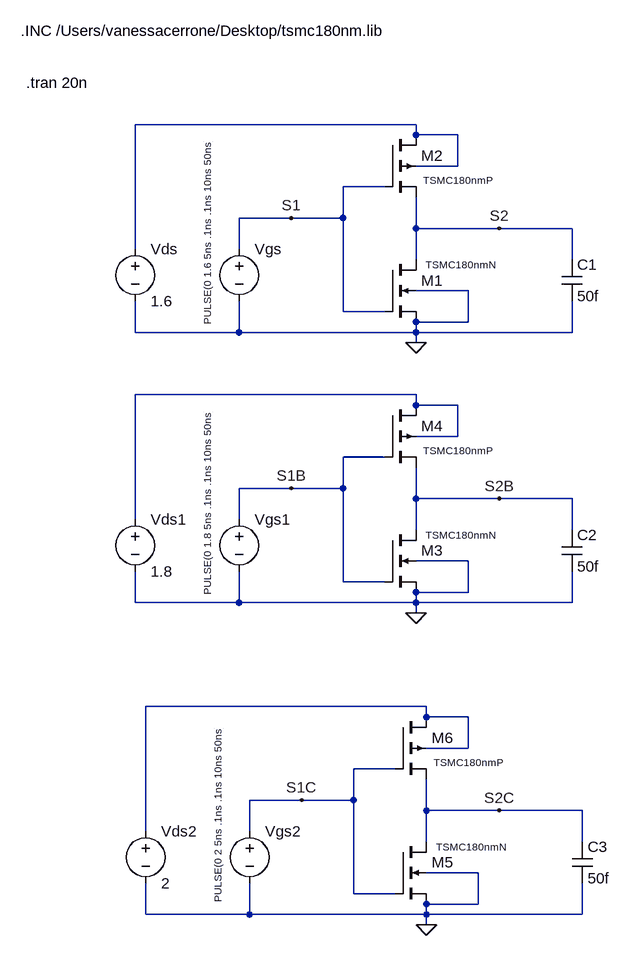
[diagram p0: schematic simulation.asc]
simulation.asc, the LTspice schematic file:
Version 4
SHEET 1 880 1488
WIRE 352 240 -80 240
WIRE 352 256 352 240
WIRE 416 256 352 256
WIRE 416 304 416 256
WIRE 416 304 352 304
WIRE 304 336 240 336
WIRE 160 384 80 384
WIRE 240 384 240 336
WIRE 240 384 160 384
WIRE 352 400 352 352
WIRE 480 400 352 400
WIRE 592 400 480 400
WIRE -80 432 -80 240
WIRE 80 432 80 384
WIRE 352 448 352 400
WIRE 592 448 592 400
WIRE 432 496 352 496
WIRE 240 528 240 384
WIRE 304 528 240 528
WIRE 432 544 432 496
WIRE 432 544 352 544
WIRE -80 560 -80 512
WIRE 80 560 80 512
WIRE 80 560 -80 560
WIRE 352 560 352 544
WIRE 352 560 80 560
WIRE 592 560 592 512
WIRE 592 560 352 560
WIRE 352 576 352 560
WIRE 352 656 -80 656
WIRE 352 672 352 656
WIRE 416 672 352 672
WIRE 416 720 416 672
WIRE 416 720 352 720
WIRE 304 752 240 752
WIRE 160 800 80 800
WIRE 240 800 240 752
WIRE 240 800 160 800
WIRE 352 816 352 768
WIRE 480 816 352 816
WIRE 592 816 480 816
WIRE -80 848 -80 656
WIRE 80 848 80 800
WIRE 352 864 352 816
WIRE 592 864 592 816
WIRE 432 912 352 912
WIRE 240 944 240 800
WIRE 304 944 240 944
WIRE 432 960 432 912
WIRE 432 960 352 960
WIRE -80 976 -80 928
WIRE 80 976 80 928
WIRE 80 976 -80 976
WIRE 352 976 352 960
WIRE 352 976 80 976
WIRE 592 976 592 928
WIRE 592 976 352 976
WIRE 352 992 352 976
WIRE 368 1136 -64 1136
WIRE 368 1152 368 1136
WIRE 432 1152 368 1152
WIRE 432 1200 432 1152
WIRE 432 1200 368 1200
WIRE 320 1232 256 1232
WIRE 176 1280 96 1280
WIRE 256 1280 256 1232
WIRE 256 1280 176 1280
WIRE 368 1296 368 1248
WIRE 480 1296 368 1296
WIRE 608 1296 480 1296
WIRE -64 1328 -64 1136
WIRE 96 1328 96 1280
WIRE 368 1344 368 1296
WIRE 608 1344 608 1296
WIRE 448 1392 368 1392
WIRE 256 1424 256 1280
WIRE 320 1424 256 1424
WIRE 448 1440 448 1392
WIRE 448 1440 368 1440
WIRE -64 1456 -64 1408
WIRE 96 1456 96 1408
WIRE 96 1456 -64 1456
WIRE 368 1456 368 1440
WIRE 368 1456 96 1456
WIRE 608 1456 608 1408
WIRE 608 1456 368 1456
WIRE 368 1472 368 1456
FLAG 352 576 0
FLAG 160 384 S1
FLAG 352 992 0
FLAG 160 800 S1B
FLAG 368 1472 0
FLAG 176 1280 S1C
FLAG 480 400 S2
FLAG 480 816 S2B
FLAG 480 1296 S2C
SYMBOL voltage -80 416 R0
SYMATTR InstName Vds
SYMATTR Value 1.6
SYMBOL voltage 80 416 R0
WINDOW 3 -38 -7 VBottom 1
SYMATTR Value PULSE(0 1.6 5ns .1ns .1ns 10ns 50ns)
SYMATTR InstName Vgs
SYMBOL nmos4 304 448 R0
WINDOW 3 63 8 Left 1
SYMATTR Value TSMC180nmN
SYMATTR InstName M1
SYMATTR Value2 l=500n w=180n
SYMBOL pmos4 304 256 R0
WINDOW 3 59 70 Left 1
SYMATTR Value TSMC180nmP
SYMATTR InstName M2
SYMATTR Value2 l=1500n w=180n
SYMBOL cap 576 448 R0
SYMATTR InstName C1
SYMATTR Value 50f
SYMBOL voltage -80 832 R0
SYMATTR InstName Vds1
SYMATTR Value 1.8
SYMBOL voltage 80 832 R0
WINDOW 3 -38 -7 VBottom 1
SYMATTR Value PULSE(0 1.8 5ns .1ns .1ns 10ns 50ns)
SYMATTR InstName Vgs1
SYMBOL nmos4 304 864 R0
WINDOW 3 63 8 Left 1
SYMATTR Value TSMC180nmN
SYMATTR InstName M3
SYMATTR Value2 l=500n w=180n
SYMBOL pmos4 304 672 R0
WINDOW 3 59 70 Left 1
SYMATTR Value TSMC180nmP
SYMATTR InstName M4
SYMATTR Value2 l=1500n w=180n
SYMBOL cap 576 864 R0
SYMATTR InstName C2
SYMATTR Value 50f
SYMBOL voltage -64 1312 R0
SYMATTR InstName Vds2
SYMATTR Value 2
SYMBOL voltage 96 1312 R0
WINDOW 3 -38 -7 VBottom 1
SYMATTR Value PULSE(0 2 5ns .1ns .1ns 10ns 50ns)
SYMATTR InstName Vgs2
SYMBOL nmos4 320 1344 R0
WINDOW 3 63 8 Left 1
SYMATTR Value TSMC180nmN
SYMATTR InstName M5
SYMATTR Value2 l=500n w=180n
SYMBOL pmos4 320 1152 R0
WINDOW 3 59 70 Left 1
SYMATTR Value TSMC180nmP
SYMATTR InstName M6
SYMATTR Value2 l=1500n w=180n
SYMBOL cap 592 1344 R0
SYMATTR InstName C3
SYMATTR Value 50f
TEXT -256 96 Left 2 !.INC /Users/vanessacerrone/Desktop/tsmc180nm.lib
TEXT -248 176 Left 2 !.tran 20n

The netlist it stands for:
* simulation.asc
Vds N001 0 1.6
Vgs S1 0 PULSE(0 1.6 5ns .1ns .1ns 10ns 50ns)
M1 S2 S1 0 0 TSMC180nmN l=500n w=180n
M2 N001 S1 S2 N001 TSMC180nmP l=1500n w=180n
C1 S2 0 50f
Vds1 N002 0 1.8
Vgs1 S1B 0 PULSE(0 1.8 5ns .1ns .1ns 10ns 50ns)
M3 S2B S1B 0 0 TSMC180nmN l=500n w=180n
M4 N002 S1B S2B N002 TSMC180nmP l=1500n w=180n
C2 S2B 0 50f
Vds2 N003 0 2
Vgs2 S1C 0 PULSE(0 2 5ns .1ns .1ns 10ns 50ns)
M5 S2C S1C 0 0 TSMC180nmN l=500n w=180n
M6 N003 S1C S2C N003 TSMC180nmP l=1500n w=180n
C3 S2C 0 50f
.model NMOS NMOS
.model PMOS PMOS
.lib standard.mos
.INC /Users/vanessacerrone/Desktop/tsmc180nm.lib
.tran 20n
.backanno
.end